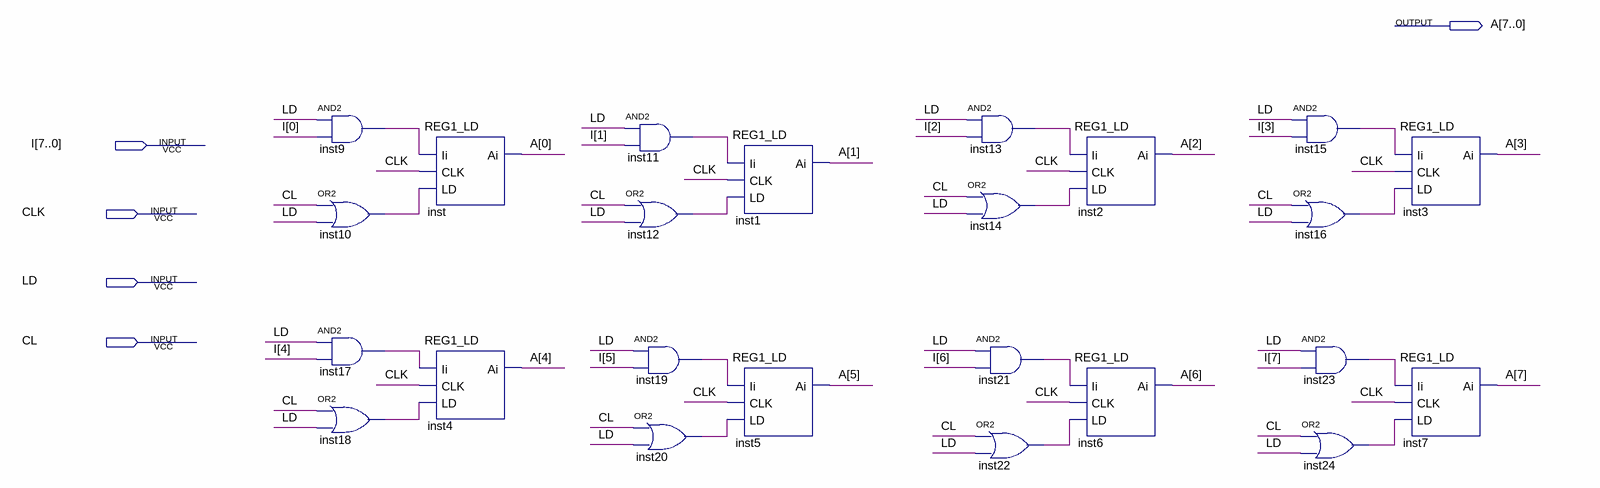
[diagram p0: schematic sheet]
// Quartus schematic REG8_LD_CL.bdf as structural Verilog: 24 symbols, 5 pins
module REG8_LD_CL (
  input  [7:0] I,
  input  CLK,
  input  LD,
  input  CL,
  output [7:0] A
);

  wire inst9_out, inst10_out, inst11_out, inst12_out, inst13_out, inst14_out, inst15_out, inst16_out,
       inst17_out, inst18_out, inst19_out, inst20_out, inst21_out, inst22_out, inst23_out, inst24_out;

  and inst9 (inst9_out, LD, I[0]);
  or inst10 (inst10_out, CL, LD);
  and inst17 (inst17_out, LD, I[4]);
  or inst18 (inst18_out, CL, LD);
  REG1_LD inst (.Ii(inst9_out), .CLK(CLK), .LD(inst10_out), .Ai(A[0]));
  REG1_LD inst4 (.Ii(inst17_out), .CLK(CLK), .LD(inst18_out), .Ai(A[4]));
  and inst11 (inst11_out, LD, I[1]);
  or inst12 (inst12_out, CL, LD);
  and inst19 (inst19_out, LD, I[5]);
  or inst20 (inst20_out, CL, LD);
  REG1_LD inst1 (.Ii(inst11_out), .CLK(CLK), .LD(inst12_out), .Ai(A[1]));
  REG1_LD inst5 (.Ii(inst19_out), .CLK(CLK), .LD(inst20_out), .Ai(A[5]));
  and inst13 (inst13_out, LD, I[2]);
  or inst14 (inst14_out, CL, LD);
  and inst21 (inst21_out, LD, I[6]);
  or inst22 (inst22_out, CL, LD);
  REG1_LD inst2 (.Ii(inst13_out), .CLK(CLK), .LD(inst14_out), .Ai(A[2]));
  REG1_LD inst6 (.Ii(inst21_out), .CLK(CLK), .LD(inst22_out), .Ai(A[6]));
  and inst15 (inst15_out, LD, I[3]);
  or inst16 (inst16_out, CL, LD);
  and inst23 (inst23_out, LD, I[7]);
  or inst24 (inst24_out, CL, LD);
  REG1_LD inst3 (.Ii(inst15_out), .CLK(CLK), .LD(inst16_out), .Ai(A[3]));
  REG1_LD inst7 (.Ii(inst23_out), .CLK(CLK), .LD(inst24_out), .Ai(A[7]));
endmodule
